# EAGLE schematic BusPirate-demo-v4 (EAGLE 5.11)
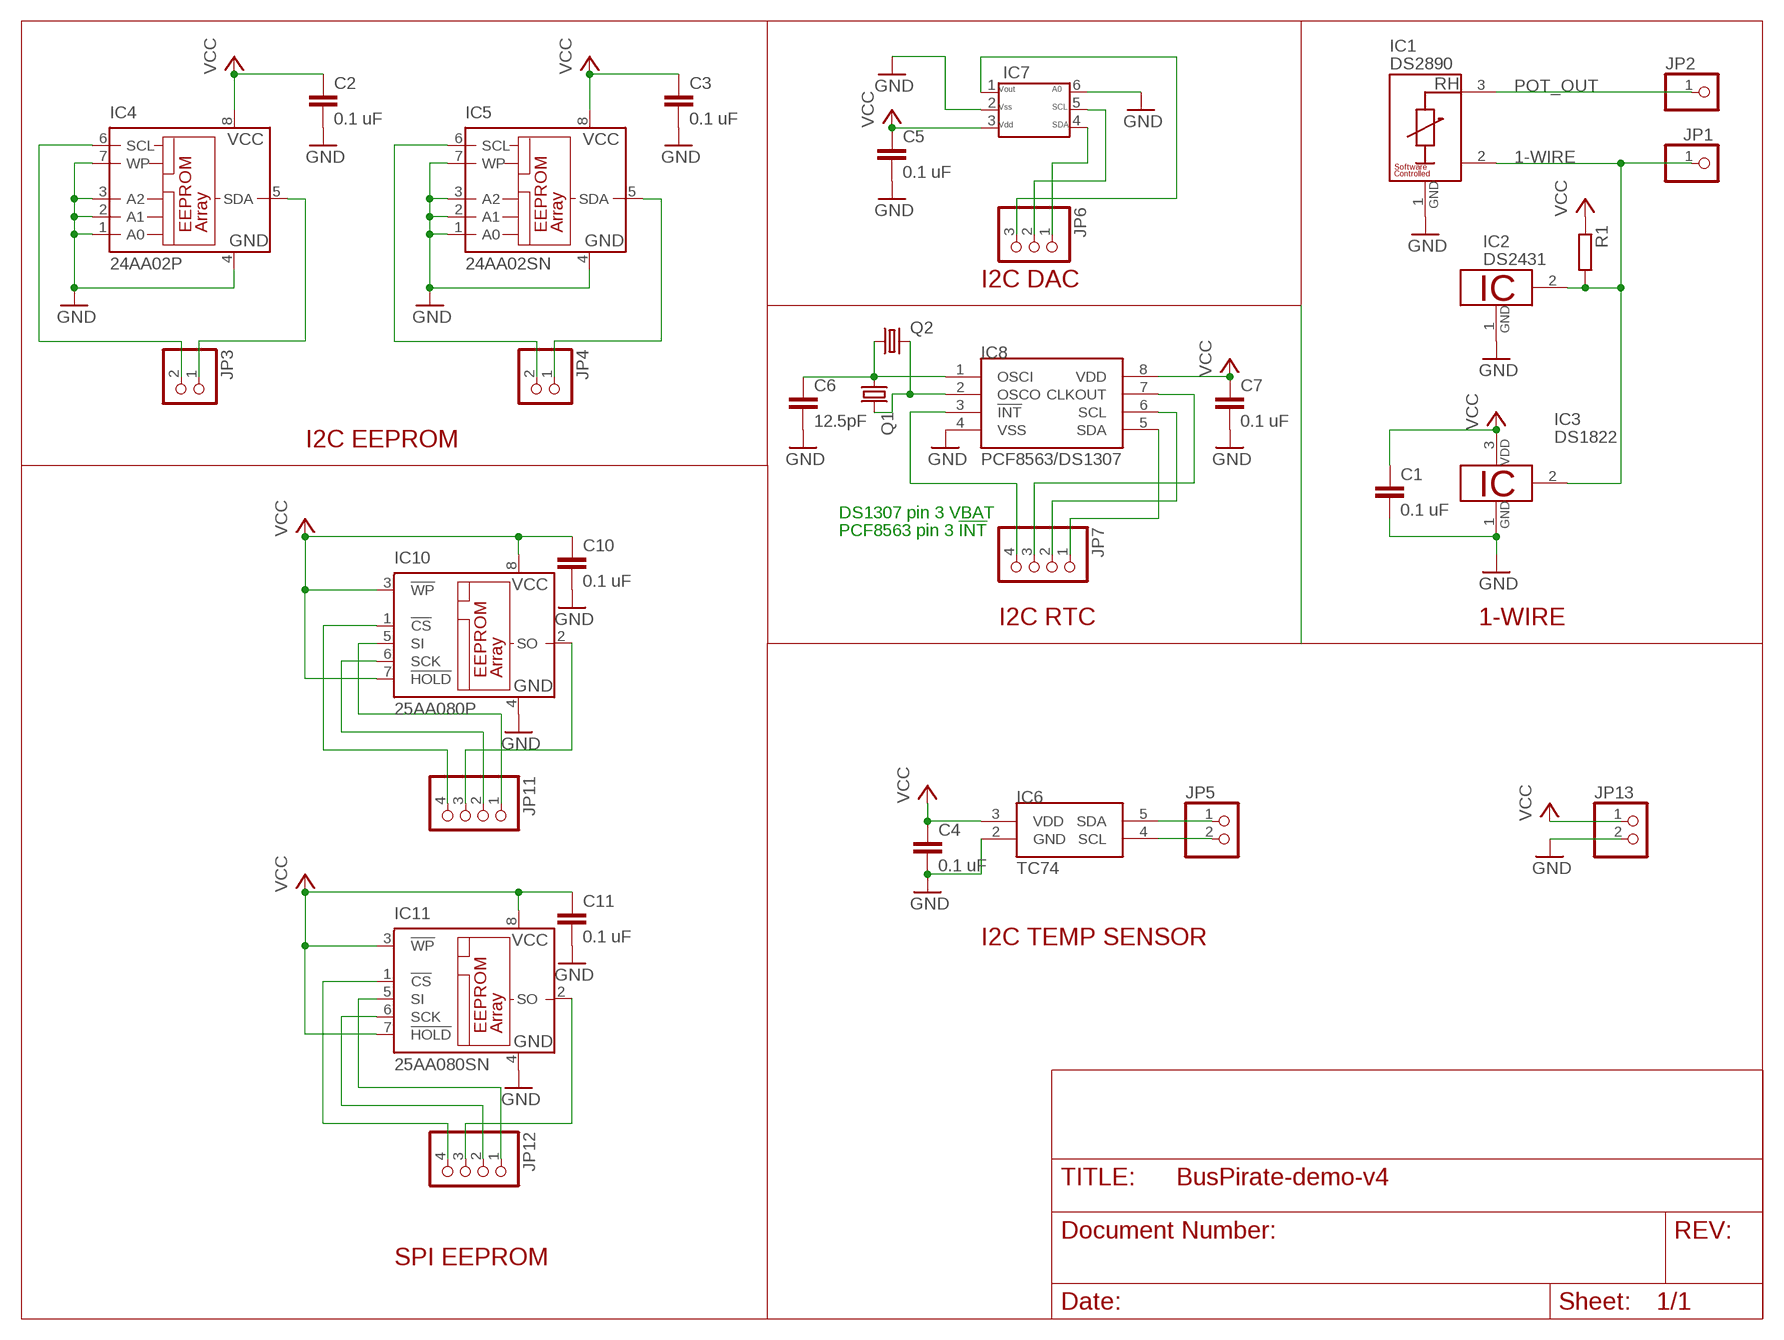
[diagram p0: schematic, sheet 1]

## Parts
C1  0.1 uF  CAPC805  [C805]
C2  0.1 uF  CAPC805  [C805]
C3  0.1 uF  CAPC805  [C805]
C4  0.1 uF  CAPC805  [C805]
C5  0.1 uF  CAPC805  [C805]
C6  12.5pF  CAPC805  [C805]
C7  0.1 uF  CAPC805  [C805]
C10  0.1 uF  CAPC805  [C805]
C11  0.1 uF  CAPC805  [C805]
IC1  DS2890  [TO92-]
IC2  DS2431  [TO92-]
IC3  DS1822  [TO92-]
IC4  24AA02P  [DIL8]
IC5  24AA02SN  [SO-08]
IC6  TC74  [SOT-23-5]
IC7  MCP4725  [SOT23-6]
IC8  PCF8563/DS1307  PCF8563  [SO8]
IC10  25AA080P  [DIL8]
IC11  25AA080SN  [SO-08]
JP1  PINHD-1X1  [1X01]
JP2  PINHD-1X1  [1X01]
JP3  PINHD-1X2  [1X02]
JP4  PINHD-1X2  [1X02]
JP5  PINHD-1X2  [1X02]
JP6  PINHD-1X3  [1X03]
JP7  PINHD-1X4  [1X04]
JP11  PINHD-1X4  [1X04]
JP12  PINHD-1X4  [1X04]
JP13  PINHD-1X2  [1X02]
Q1  CRYSTALMM20SS  [MM20SS]
Q2  CRYSTALTC26H  [TC26H]
R1  RESISTORR805R805  [R805]

## Nets
1: IC4.6(SCL) JP3.2
1-WIRE: IC1.2 IC2.2(1W) IC3.2 JP1.1 R1.2
2: IC4.5(SDA) JP3.1
3: IC5.6(SCL) JP4.2
4: IC5.5(SDA) JP4.1
5: IC6.5(SDA) JP5.1
6: IC6.4(SCL) JP5.2
8: IC7.5 JP6.2
10: IC7.1 JP6.3
11: IC8.3(!INT) JP7.4
12: IC8.7(CLKOUT) JP7.3
13: IC8.6(SCL) JP7.2
14: IC8.5(SDA) JP7.1
GND: C1.2 C2.2 C3.2 C4.2 C5.2 C6.2 C7.2 C10.2 C11.2 IC1.1 IC2.1(GND) IC3.1 IC4.1(A0) IC4.2(A1) IC4.3(A2) IC4.4(GND) IC4.7(WP) IC5.1(A0) IC5.2(A1) IC5.3(A2) IC5.4(GND) IC5.7(WP) IC6.2(GND) IC7.2 IC7.6 IC8.4(VSS) IC10.4(GND) IC11.4(GND) JP13.2
N$1: IC7.4 JP6.1
N$6: C6.1 IC8.1(OSCI) Q1.1 Q2.1
N$14: IC8.2(OSCO) Q1.4 Q2.2
N$20: IC10.1(!CS) JP11.4
N$21: IC10.2(SO) JP11.3
N$22: IC11.2(SO) JP12.3
N$24: IC10.5(SI) JP11.1
N$30: IC10.6(SCK) JP11.2
N$31: IC11.5(SI) JP12.1
N$32: IC11.6(SCK) JP12.2
N$52: IC11.1(!CS) JP12.4
POT_OUT: IC1.3 JP2.1
VCC: C1.1 C2.1 C3.1 C4.1 C5.1 C7.1 C10.1 C11.1 IC3.3 IC4.8(VCC) IC5.8(VCC) IC6.3(VDD) IC7.3 IC8.8(VDD) IC10.3(!WP) IC10.7(!HOLD) IC10.8(VCC) IC11.3(!WP) IC11.7(!HOLD) IC11.8(VCC) JP13.1 R1.1

## Notes on the sheet
- I2C DAC
- I2C EEPROM
- DS1307 pin 3 VBAT
- PCF8563 pin 3 !INT
- I2C RTC | 1-WIRE
- I2C TEMP SENSOR
- SPI EEPROM

## Library data of the parts
C1-C7 C10 C11 = dp_devices:CAP
IC1 = 1wire:DS2890: 1-Wire Digital Potentiometer This chip provides a 0..100k RH to GND resistor which can be controlled by software in 256 steps. The RH pin may be connected to levels from 0..11V. Notes: The DS2890P is the same chip in a TSOC6 package with 3 additional pins Vdd, WI and RL, which allows to use the chip as a full featured potentiometer. Author: Jan Kandziora <jjj@gmx.de>
IC2 = 1wire:DS2431: 1024-Bit EEPROM This chip provides a 4x256 Bit EEPROM, which can be programmed@5V. Write protection and OTP emulation are available, too. Author: Jan Kandziora <jjj@gmx.de>
IC3 = 1wire:DS1822: Econo Digital Thermometer This chip provides a onewire thermosensor with approx. 2°C accuracy. A programmable over/undertemperure alarm is available. Notes: Vdd must be applied for accurate measurements at low temperatures, as the parasite power circuit otherwise heats the sensor. If parasite power is used, Vdd has to be connected to GND. The DS18B20 and DS18S20 are similar chips with approx. 0.5°C accuracy. Author: Jan Kandziora <jjj@gmx.de>
IC4 IC5 = microchip:24*: Serial EEPROM I2C
IC6 = dp_devices:TC74
IC7 = dp_devices:MCP4725
IC8 = dp_devices:PCF8563
IC10 IC11 = microchip:25*: Serial EEPROM 4K/ 8K , SPI bus
JP1 JP2 = pinhead - Copy:PINHD-1X1: PIN HEADER
JP3-JP5 JP13 = pinhead - Copy:PINHD-1X2: PIN HEADER
JP6 = pinhead - Copy:PINHD-1X3: PIN HEADER
JP7 JP11 JP12 = pinhead - Copy:PINHD-1X4: PIN HEADER
Q1 Q2 = crystal:CRYSTAL: CRYSTAL
R1 = dp_devices:RESISTOR